# EAGLE design BBG_PROFET (EAGLE 9.5.2)
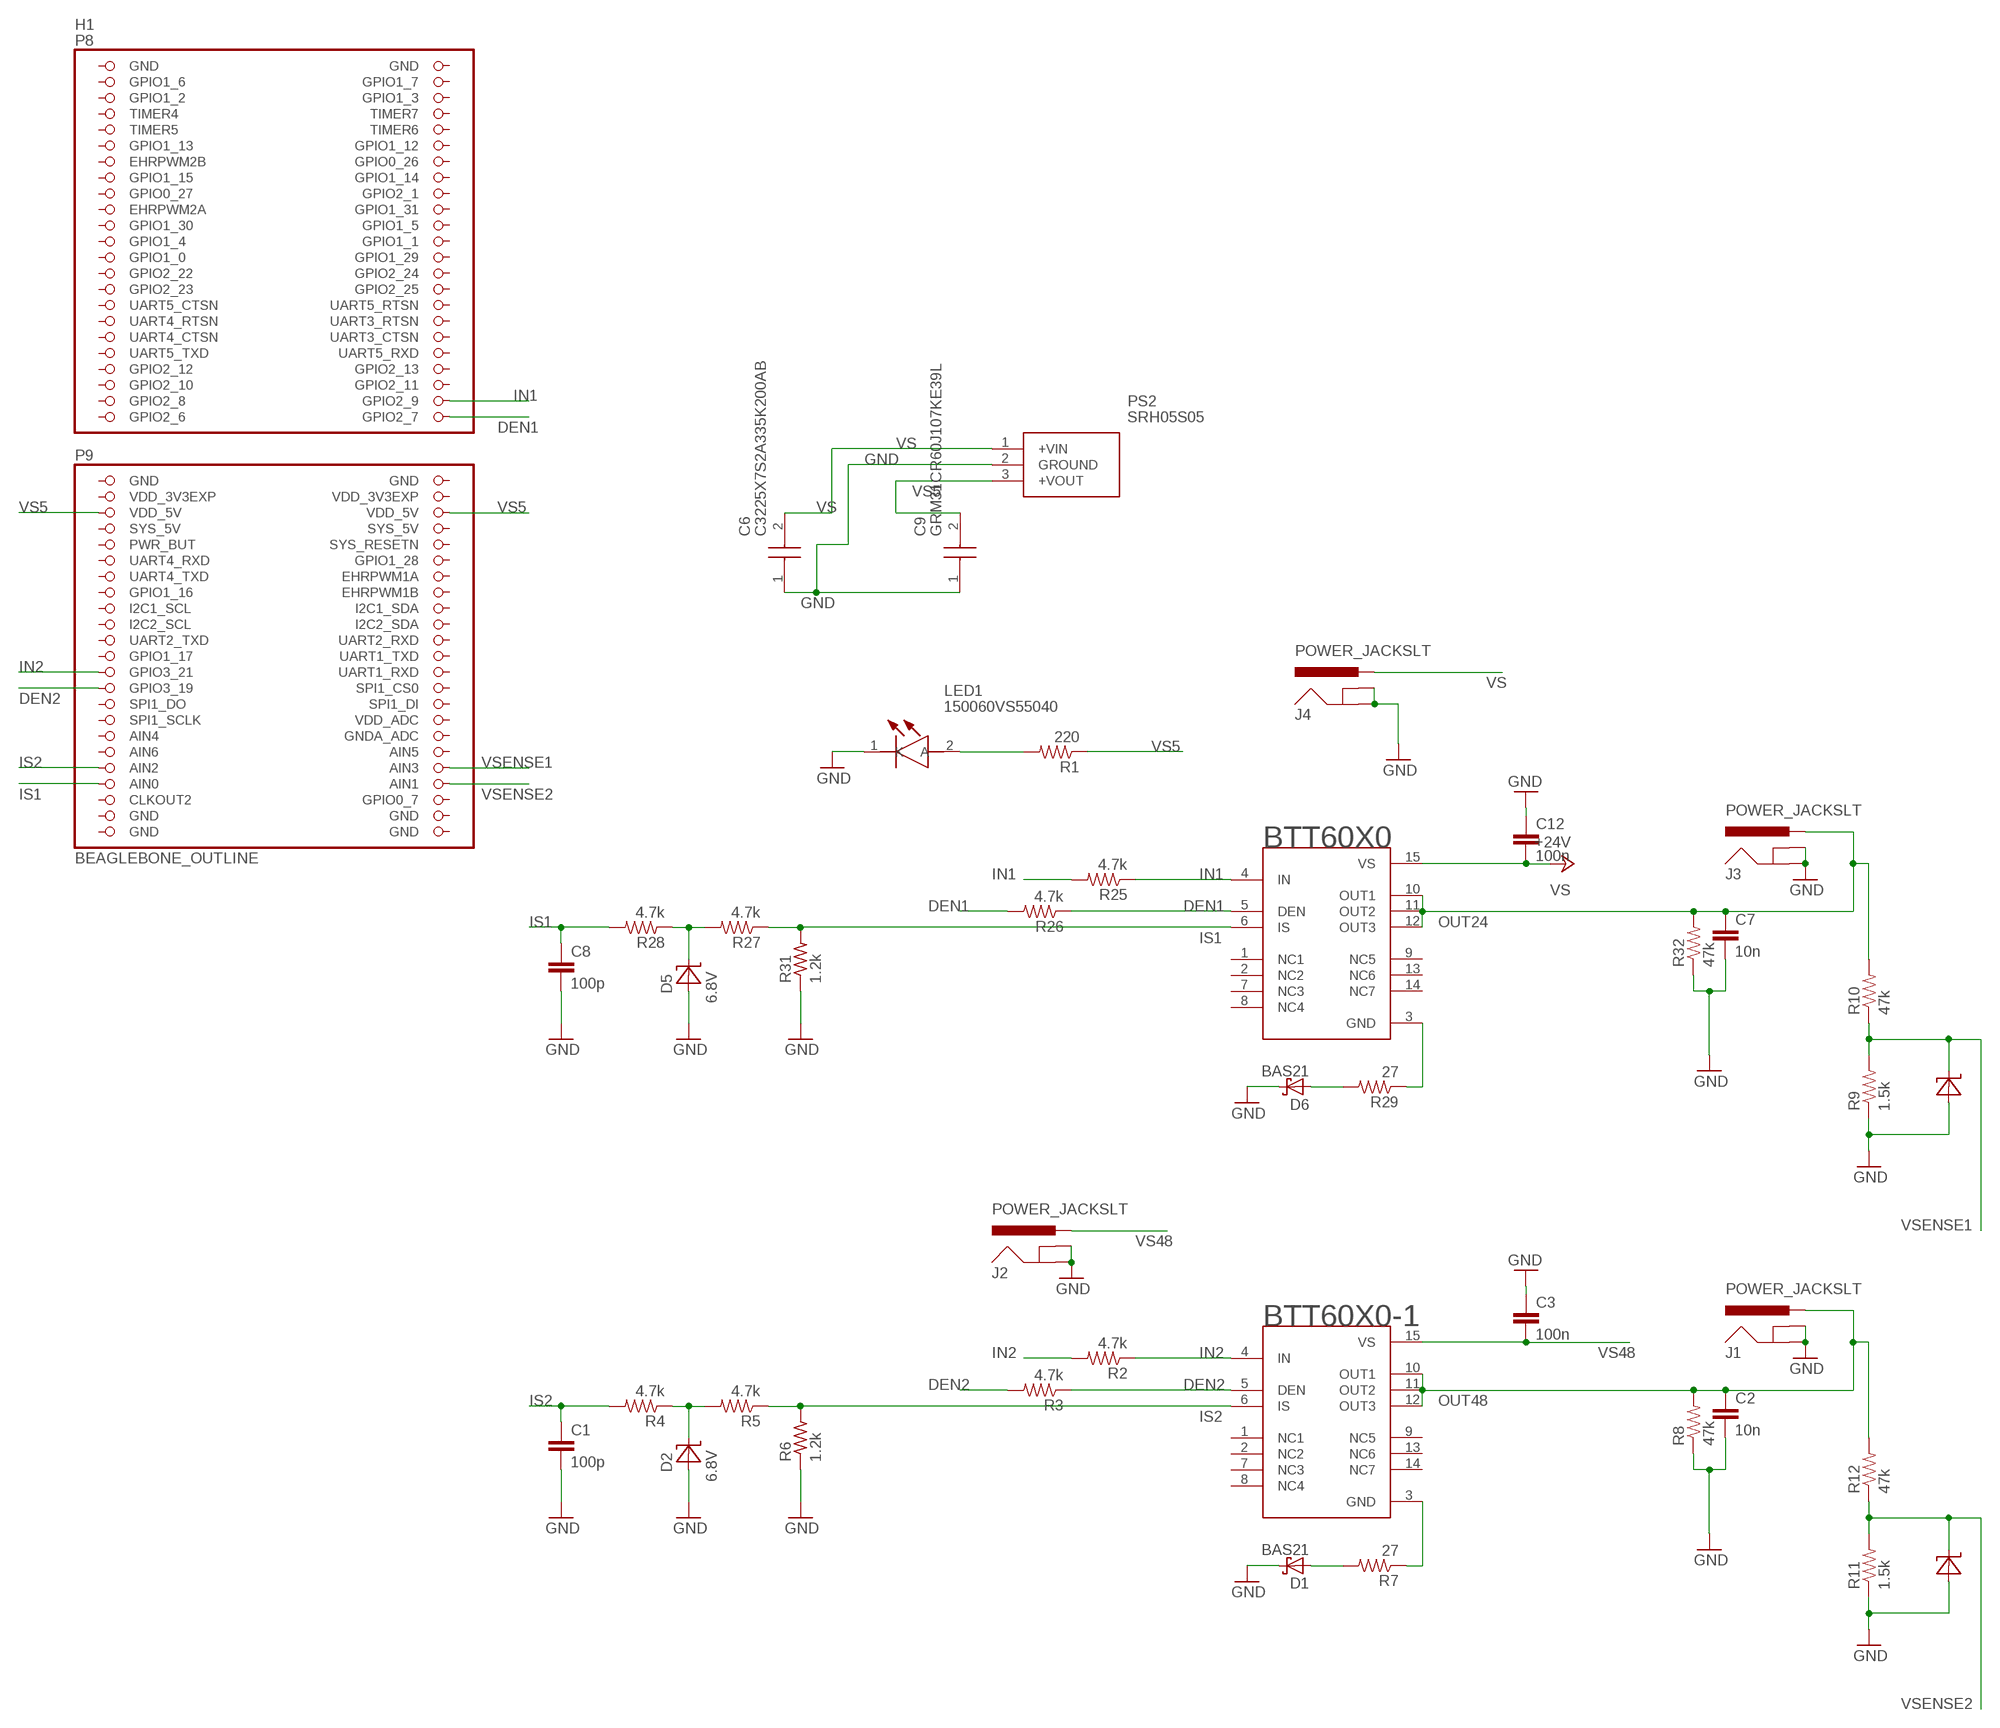
[diagram p0: schematic, sheet 1]

## Parts
BTT60X0  BTT6020-1ERA  [SOIC127P600X115-15N-V1]
BTT60X0-1  BTT6020-1ERA  [SOIC127P600X115-15N-V1]
C1  100p  CAP0603-CAP  [0603-CAP]
C2  10n  CAP0603-CAP  [0603-CAP]
C3  100n  CAP0603-CAP  [0603-CAP]
C6  C3225X7S2A335K200AB  [CAPC3225X200N]
C7  10n  CAP0603-CAP  [0603-CAP]
C8  100p  CAP0603-CAP  [0603-CAP]
C9  GRM31CR60J107KE39L  [CAPC3216X180N]
C12  100n  CAP0603-CAP  [0603-CAP]
D1  BAS21  BAS40  [SOT23]
D2  6.8V  SMD-PACKAGES_ZMM  [SMD-PACKAGES_SOD80]
D3  1.8V  SMD-PACKAGES_ZMM  [SMD-PACKAGES_SOD80]
D4  1.8V  SMD-PACKAGES_ZMM  [SMD-PACKAGES_SOD80]
D5  6.8V  SMD-PACKAGES_ZMM  [SMD-PACKAGES_SOD80]
D6  BAS21  BAS40  [SOT23]
H1  BEAGLEBONE_OUTLINE  [BEAGLEBONE_SHIELD]
J1  POWER_JACKSLT  [POWER_JACK_SLOT]
J2  POWER_JACKSLT  [POWER_JACK_SLOT]
J3  POWER_JACKSLT  [POWER_JACK_SLOT]
J4  POWER_JACKSLT  [POWER_JACK_SLOT]
LED1  150060VS55040  [LEDM168X50N]
PS2  SRH05S05  [SRH05S05]
R1  220  RESISTOR0603-RES  [0603-RES]
R2  4.7k  RESISTOR0603-RES  [0603-RES]
R3  4.7k  RESISTOR0603-RES  [0603-RES]
R4  4.7k  RESISTOR0603-RES  [0603-RES]
R5  4.7k  RESISTOR0603-RES  [0603-RES]
R6  1.2k  R-US_R1206  [R1206]
R7  27  RESISTOR0603-RES  [0603-RES]
R8  47k  RESISTOR0603-RES  [0603-RES]
R9  1.5k  RESISTOR0603-RES  [0603-RES]
R10  47k  RESISTOR0603-RES  [0603-RES]
R11  1.5k  RESISTOR0603-RES  [0603-RES]
R12  47k  RESISTOR0603-RES  [0603-RES]
R25  4.7k  RESISTOR0603-RES  [0603-RES]
R26  4.7k  RESISTOR0603-RES  [0603-RES]
R27  4.7k  RESISTOR0603-RES  [0603-RES]
R28  4.7k  RESISTOR0603-RES  [0603-RES]
R29  27  RESISTOR0603-RES  [0603-RES]
R31  1.2k  R-US_R1206  [R1206]
R32  47k  RESISTOR0603-RES  [0603-RES]

## Nets
DEN1: BTT60X0.5(DEN) H1.46(GPIO2_7) R26.1 R26.2
DEN2: BTT60X0-1.5(DEN) H1.73(GPIO3_19) R3.1 R3.2
GND: BTT60X0.3(GND) C1.2 C2.2 C3.1 C6.1 C7.2 C8.2 C9.1 C12.1 D1.3(C) D2.A D3.A D4.A D5.A D6.1(A) D6.3(C) J1.GND@1(GNDBREAK) J1.GND@2(GND) J2.GND@1(GNDBREAK) J2.GND@2(GND) J3.GND@1(GNDBREAK) J3.GND@2(GND) J4.GND@1(GNDBREAK) J4.GND@2(GND) LED1.1(K) PS2.2(GROUND) R6.1 R8.1 R9.1 R11.1 R29.1 R29.2 R31.1 R32.1
IN1: BTT60X0.4(IN) H1.44(GPIO2_9) R25.1 R25.2
IN2: BTT60X0-1.4(IN) H1.71(GPIO3_21) R2.1 R2.2
IS1: BTT60X0.6(IS) C8.1 D5.K(C) H1.85(AIN0) R27.1 R27.2 R28.1 R28.2 R31.2
IS2: BTT60X0-1.6(IS) C1.1 D2.K(C) H1.83(AIN2) R4.1 R4.2 R5.1 R5.2 R6.2
N$5: LED1.2(A) R1.2
N$6: BTT60X0-1.3(GND) R7.1
N$8: D1.1(A) R7.2
OUT24: BTT60X0.10(OUT1) BTT60X0.11(OUT2) BTT60X0.12(OUT3) C7.1 J3.PWR R10.2 R32.2
OUT48: BTT60X0-1.10(OUT1) BTT60X0-1.11(OUT2) BTT60X0-1.12(OUT3) C2.1 J1.PWR R8.2 R12.2
VS: BTT60X0.15(VS) C6.2 C12.2 J4.PWR PS2.1(+VIN) ; supply symbol labelled +24V
VS5: C9.2 H1.51(VDD_5V) H1.52(VDD_5V) PS2.3(+VOUT) R1.1
VS48: BTT60X0-1.15(VS) C3.2 J2.PWR
VSENSE1: D3.K(C) H1.84(AIN3) R9.2 R10.1
VSENSE2: D4.K(C) H1.86(AIN1) R11.2 R12.1
Unconnected: BTT60X0-1.1(NC1) BTT60X0-1.2(NC2) BTT60X0-1.7(NC3) BTT60X0-1.8(NC4) BTT60X0-1.9(NC5) BTT60X0-1.13(NC6) BTT60X0-1.14(NC7) BTT60X0.1(NC1) BTT60X0.2(NC2) BTT60X0.7(NC3) BTT60X0.8(NC4) BTT60X0.9(NC5) BTT60X0.13(NC6) BTT60X0.14(NC7) H1.3(GPIO1_6) H1.4(GPIO1_7) H1.5(GPIO1_2) H1.6(GPIO1_3) H1.7(TIMER4) H1.8(TIMER7) H1.9(TIMER5) H1.10(TIMER6) H1.11(GPIO1_13) H1.12(GPIO1_12) H1.13(EHRPWM2B) H1.14(GPIO0_26) H1.15(GPIO1_15) H1.16(GPIO1_14) H1.17(GPIO0_27) H1.18(GPIO2_1) H1.19(EHRPWM2A) H1.20(GPIO1_31) H1.21(GPIO1_30) H1.22(GPIO1_5) H1.23(GPIO1_4) H1.24(GPIO1_1) H1.25(GPIO1_0) H1.26(GPIO1_29) H1.27(GPIO2_22) H1.28(GPIO2_24) H1.29(GPIO2_23) H1.30(GPIO2_25) H1.31(UART5_CTSN) H1.32(UART5_RTSN) H1.33(UART4_RTSN) H1.34(UART3_RTSN) H1.35(UART4_CTSN) H1.36(UART3_CTSN) H1.37(UART5_TXD) H1.38(UART5_RXD) H1.39(GPIO2_12) H1.40(GPIO2_13) H1.41(GPIO2_10) H1.42(GPIO2_11) H1.43(GPIO2_8) H1.45(GPIO2_6) H1.54(SYS_5V) H1.55(PWR_BUT) H1.56(SYS_RESETN) H1.57(UART4_RXD) H1.58(GPIO1_28) H1.59(UART4_TXD) H1.60(EHRPWM1A) H1.61(GPIO1_16) H1.62(EHRPWM1B) H1.63(I2C1_SCL) H1.64(I2C1_SDA) H1.65(I2C2_SCL) H1.66(I2C2_SDA) H1.67(UART2_TXD) H1.68(UART2_RXD) H1.69(GPIO1_17) H1.70(UART1_TXD) H1.72(UART1_RXD) H1.74(SPI1_CS0) H1.75(SPI1_DO) H1.76(SPI1_DI) H1.77(SPI1_SCLK) H1.78(VDD_ADC) H1.79(AIN4) H1.80(GNDA_ADC) H1.81(AIN6) H1.82(AIN5) H1.87(CLKOUT2) H1.88(GPIO0_7)

## Power pins joined to a net without a drawn wire
GND: H1.1(GND) H1.2(GND) H1.47(GND) H1.48(GND) H1.89(GND) H1.90(GND) H1.91(GND) H1.92(GND)
SYS_5V: H1.53(SYS_5V)
VDD_3V3EXP: H1.49(VDD_3V3EXP) H1.50(VDD_3V3EXP)

## Library data of the parts
BTT60X0 BTT60X0-1 = BTT6020-1ERA:BTT6020-1ERA: BTT6020-1ERA SOIC127P600X115-15N-V1 Smart High-Side Power Switch Single Channel
C1-C3 C7 C8 C12 = SparkFun:CAP: Capacitor Standard 0603 ceramic capacitor, and 0.1" leaded capacitor.
C6 = SamacSys_Parts:C3225X7S2A335K200AB: TDK 1210 C 3.3uF Ceramic Multilayer Capacitor, 100 V dc, +125C, X7S Dielectric, +/-10% Source: Datasheet <https://componentsearchengine.com/Datasheets/1/C3225X7S2A335K200AB.pdf>; DESCRIPTION: TDK 1210 C 3.3uF Ceramic Multilayer Capacitor, 100 V dc, +125C, X7S Dielectric, +/-10%; HEIGHT: 2mm; MANUFACTURER_NAME: TDK; MANUFACTURER_PART_NUMBER: C3225X7S2A335K200AB; MOUSER_PART_NUMBER: 810-C3225X7S2A335K; MOUSER_PRICE-STOCK: https://www.mouser.com/Search/Refine.aspx?Keyword=810-C3225X7S2A335K
C9 = SamacSys_Parts:GRM31CR60J107KE39L: Multilayer Ceramic Capacitors MLCC - SMD/SMT Source: Datasheet <https://componentsearchengine.com/Datasheets/1/GRM31CR60J107KE39L.pdf>; DESCRIPTION: Multilayer Ceramic Capacitors MLCC - SMD/SMT; HEIGHT: 1.8mm; MANUFACTURER_NAME: Murata Electronics; MANUFACTURER_PART_NUMBER: GRM31CR60J107KE39L; MOUSER_PART_NUMBER: 81-GRM31CR60J107KE9L; MOUSER_PRICE-STOCK: https://www.mouser.com/Search/Refine.aspx?Keyword=81-GRM31CR60J107KE9L
D1 D6 = diode:BAS40: Silicon Schottky Diodes General-purpose diode for high-speed switching
D2-D5 = NovalithIC_H-Bridge_Demo_Board_V2_2:SMD-PACKAGES_ZMM: Werte: 1V, 2,7V ...51V Reihe E24
H1 = adafruit:BEAGLEBONE_OUTLINE: Should match A3 pinout - but not completely tested
J1-J4 = SparkFun-Connectors:POWER_JACK: Power Jack Connector This is the standard 5.5mm barrel jack for power. The PTH is the most common, proven, reliable, footprint. The Slot footprint only works if the mill layer is transmitted to the PCB fab house so be warned. Here are the connectors we sell at SparkFun: DC Barrel Power Jack/Connector <https://www.sparkfun.com/products/119> (PRT-00119) DC Barrel Power Jack/Connector (SMD) <https://www.sparkfun.com/products/12748> (PRT-12748) DC Barrel Jack Adapter - Breadboard Compatible <https://www.sparkfun.com/products/10811> (PRT-10811) It is used on this SparkFun product (and many, many others): SparkFun RedBoard - Programmed with Arduino <https://www.sparkfun.com/products/12757> (DEV-12757) Also, if you need a mating power supply or connector, please check these out: Wall Adapter Power Supply - 9VDC 650mA <https://www.sparkfun.com/products/298> (TOL-00298) DC Barrel Jack Adapter - Male <https://www.sparkfun.com/products/10287> (PRT-10287); PROD_ID: PRT-00119
LED1 = SamacSys_Parts:150060VS55040: LED, 150060VS55040, Wurth Elektronik WL-SMCD 573 (Typ.) nm 0603 Diffused SMD package Source: Datasheet <https://componentsearchengine.com/Datasheets/1/150060VS55040.pdf>; DESCRIPTION: LED, 150060VS55040, Wurth Elektronik WL-SMCD 573 (Typ.) nm 0603 Diffused SMD package; HEIGHT: 0.5mm; MANUFACTURER_NAME: Wurth Elektronik; MANUFACTURER_PART_NUMBER: 150060VS55040; MOUSER_PART_NUMBER: 710-150060VS55040; MOUSER_PRICE-STOCK: https://www.mouser.com/Search/Refine.aspx?Keyword=710-150060VS55040
PS2 = SamacSys_Parts:SRH05S05: XP Power DC-DC Switching Regulator, 9 72V dc Input, 5V dc Output, 500mA Source: Datasheet <https://componentsearchengine.com/Datasheets/1/SRH05S05.pdf>; DESCRIPTION: XP Power DC-DC Switching Regulator, 9 72V dc Input, 5V dc Output, 500mA; HEIGHT: 10.66mm; MANUFACTURER_NAME: XP POWER; MANUFACTURER_PART_NUMBER: SRH05S05; MOUSER_PART_NUMBER: 209-SRH05S05; MOUSER_PRICE-STOCK: https://www.mouser.com/Search/Refine.aspx?Keyword=209-SRH05S05
R1-R5 R7-R12 R25-R29 R32 = SparkFun:RESISTOR: Resistor Basic schematic elements and footprints for 0603, 1206, and PTH 1/10th watt (small) resistors.
R6 R31 = resistor:R-US_: RESISTOR, American symbol

## Board
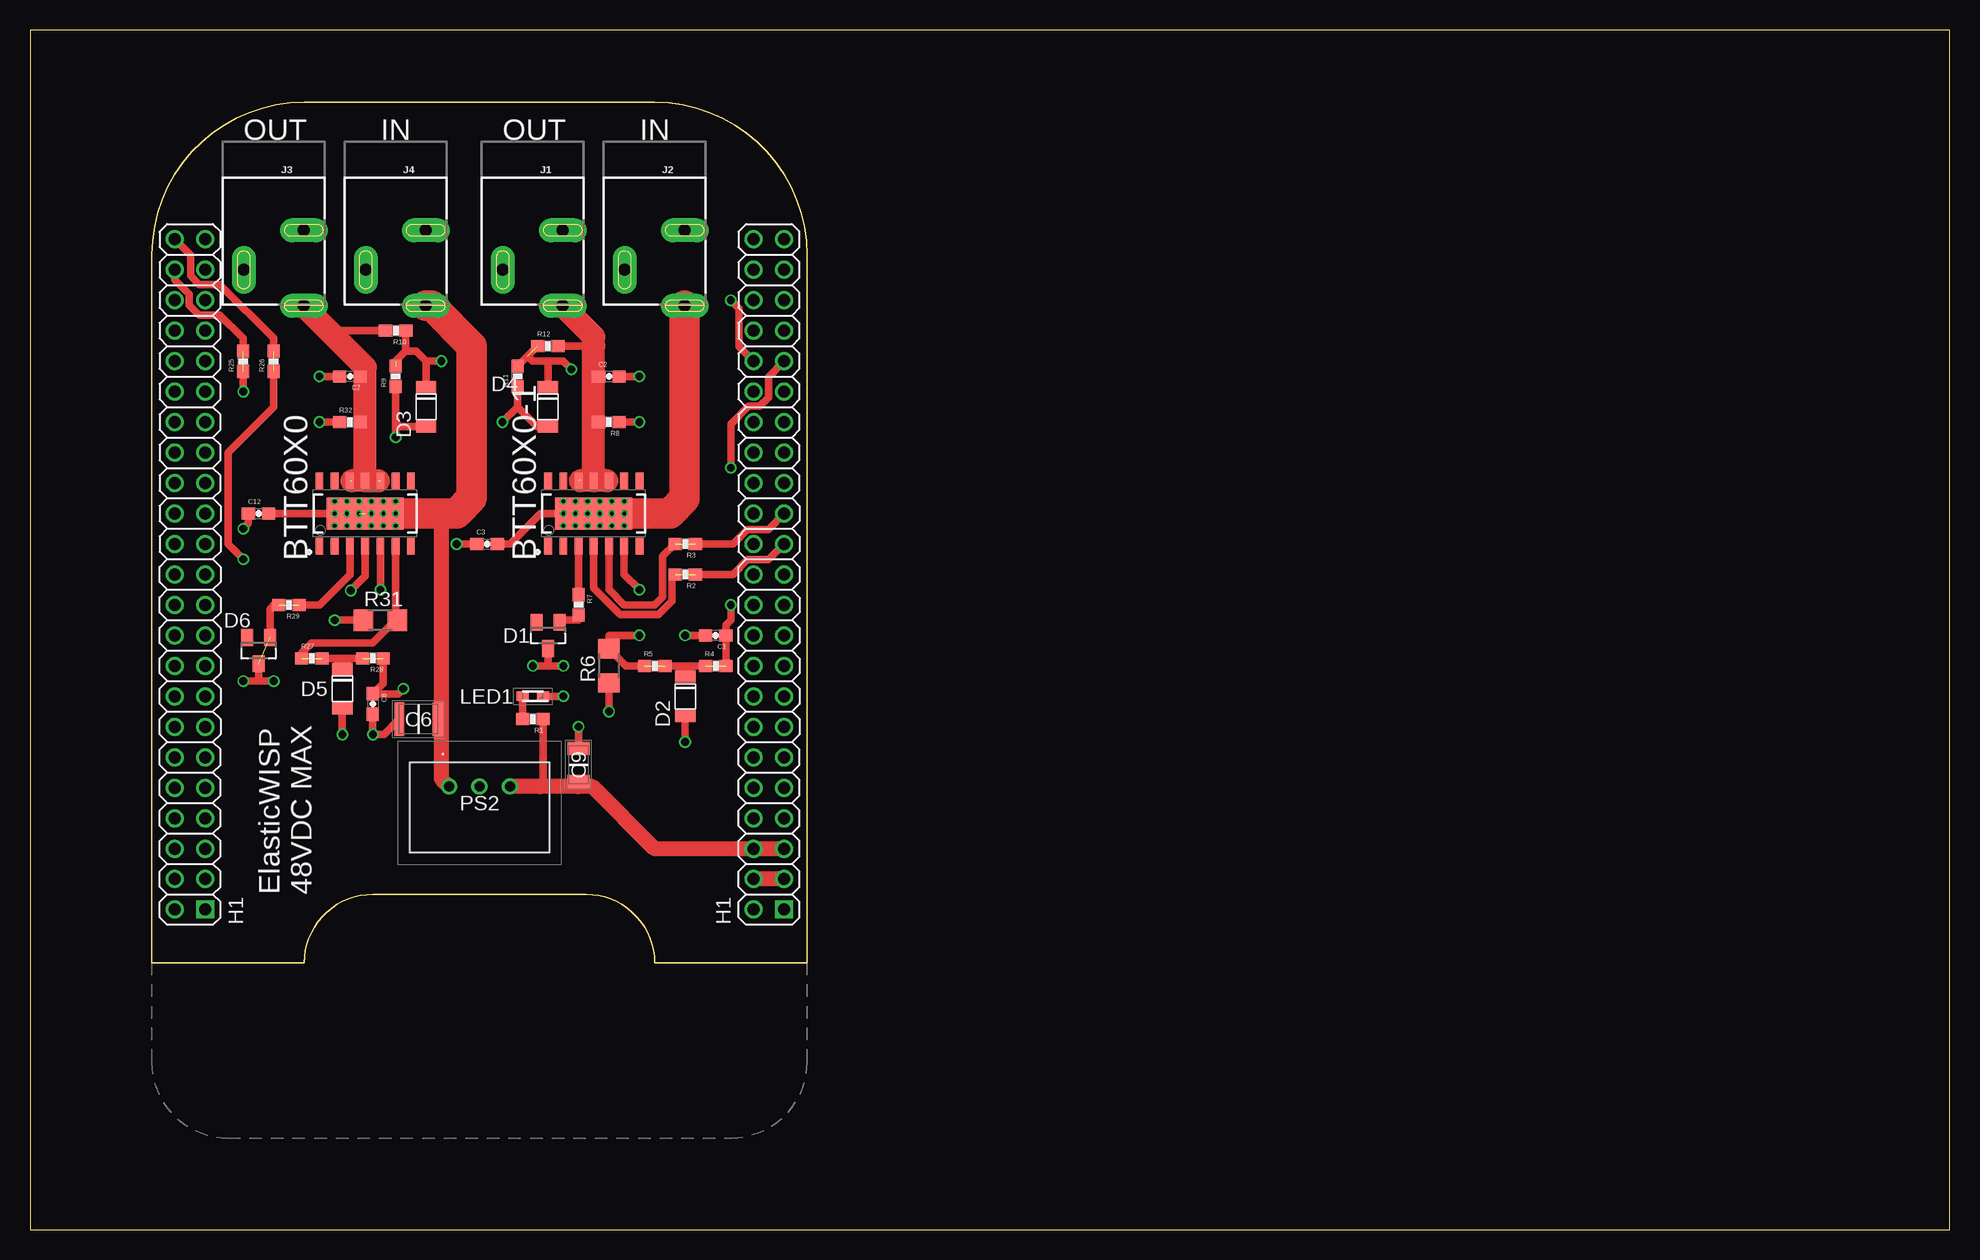
[diagram p1: board, top side]
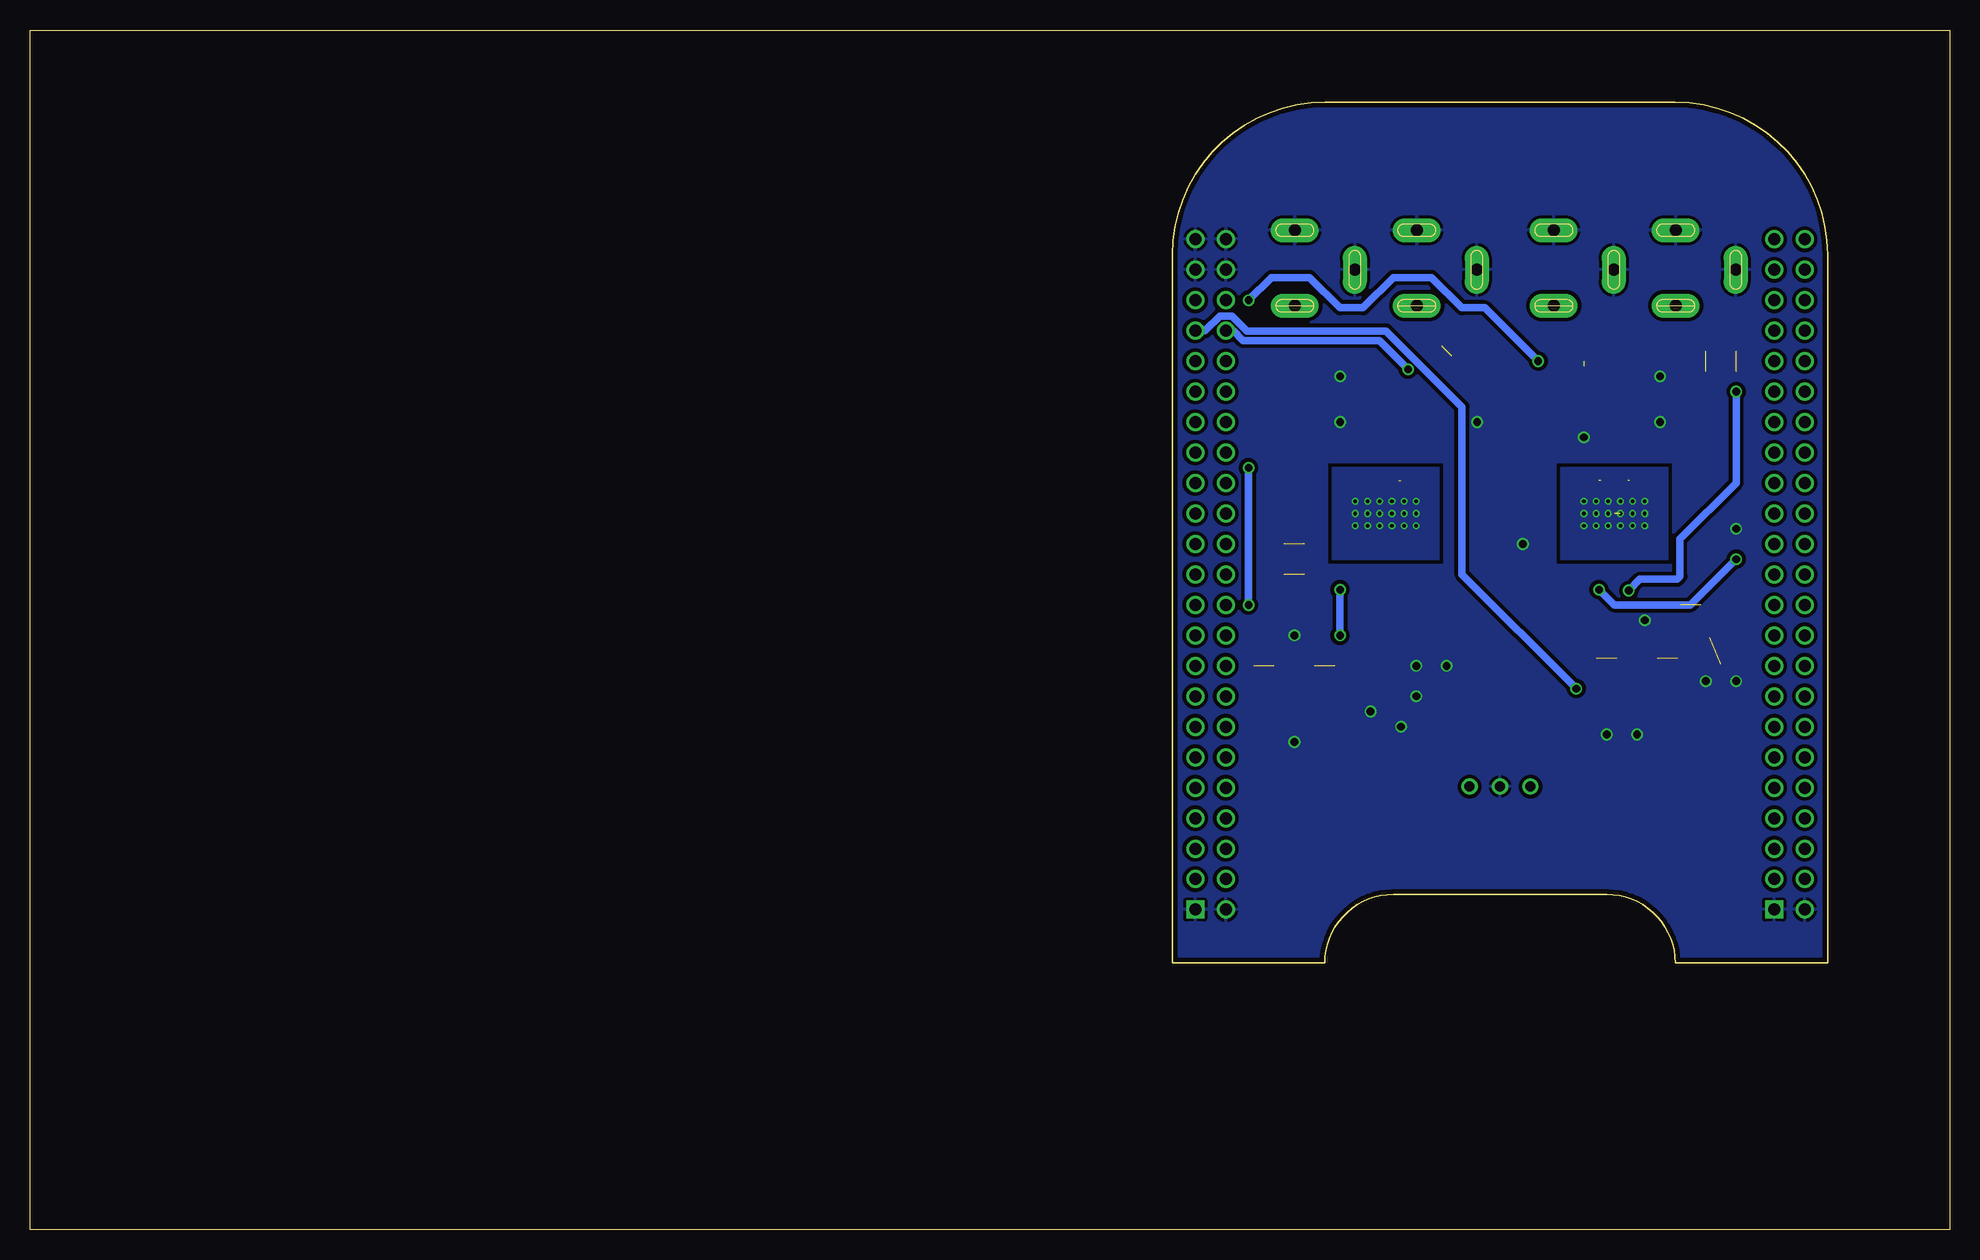
[diagram p2: board, bottom side, seen from below]

Size 160 x 100 mm. Coordinates in mm from the lower left corner, seen from the top.
Outline: 0,0 160,0 160,100 0,100 0,0
Copper layers (1*16): Top 0.035559375mm / dielectric 1.6mm / Bottom 0.035559375mm
Design rules "oshpark-2layer": minimum track width 6mil, minimum drill 10mil, track to track 6mil, track to pad 6mil, pad to pad 6mil, via to via 6mil, smd to smd 6mil, copper to edge 15mil, drill to drill 6mil, minimum pad ring 5mil, minimum via ring 5mil, stop-mask expansion 2.5mil, vias tented up to drill 0mil, thermal gap 10mil

### Footprints (pad centres in the part's own frame; a part is rotated, then mirrored left to right if it is on the bottom)
SOIC127P600X115-15N-V1 = smd 1.34 x 0.65: 1 -2.73,3.81; 2 -2.73,2.54; 3 -2.73,1.27; 4 -2.73,0; 5 -2.73,-1.27; 6 -2.73,-2.54; 7 -2.73,-3.81; 8 2.73,-3.81; 9 2.73,-2.54; 10 2.73,-1.27; 11 2.73,0; 12 2.73,1.27; 13 2.73,2.54; 14 2.73,3.81 | smd 2.65 x 6.4: 15 0,0
0603-CAP = smd 1.1 x 1: 1 -0.85,0; 2 0.85,0
CAPC3225X200N = smd 0.81 x 2.82: 1 -1.6,0; 2 1.6,0
CAPC3216X180N = smd 1.07 x 1.82: 1 -1.38,0; 2 1.38,0
SOT23 = smd 1 x 1.4: 1 -0.95,-1.1; 2 0.95,-1.1; 3 0,1.1
SMD-PACKAGES_SOD80 = smd 1 x 1.7: A -1.65,0; K 1.65,0
BEAGLEBONE_SHIELD = drill 1 square: 1 4.445,19.05; 47 52.705,19.05 | drill 1: 2 1.905,19.05; 3 4.445,21.59; 4 1.905,21.59; 5 4.445,24.13; 6 1.905,24.13; 7 4.445,26.67; 8 1.905,26.67; 9 4.445,29.21; 10 1.905,29.21; 11 4.445,31.75; 12 1.905,31.75; 13 4.445,34.29; 14 1.905,34.29; 15 4.445,36.83; 16 1.905,36.83; 17 4.445,39.37; 18 1.905,39.37; 19 4.445,41.91; 20 1.905,41.91; 21 4.445,44.45; 22 1.905,44.45; 23 4.445,46.99; 24 1.905,46.99; 25 4.445,49.53; 26 1.905,49.53; 27 4.445,52.07; 28 1.905,52.07; 29 4.445,54.61; 30 1.905,54.61; 31 4.445,57.15; 32 1.905,57.15; 33 4.445,59.69; 34 1.905,59.69; 35 4.445,62.23; 36 1.905,62.23; 37 4.445,64.77; 38 1.905,64.77; 39 4.445,67.31; 40 1.905,67.31; 41 4.445,69.85; 42 1.905,69.85; 43 4.445,72.39; 44 1.905,72.39; 45 4.445,74.93; 46 1.905,74.93; 48 50.165,19.05; 49 52.705,21.59; 50 50.165,21.59; 51 52.705,24.13; 52 50.165,24.13; 53 52.705,26.67; 54 50.165,26.67; 55 52.705,29.21; 56 50.165,29.21; 57 52.705,31.75; 58 50.165,31.75; 59 52.705,34.29; 60 50.165,34.29; 61 52.705,36.83; 62 50.165,36.83; 63 52.705,39.37; 64 50.165,39.37; 65 52.705,41.91; 66 50.165,41.91; 67 52.705,44.45; 68 50.165,44.45; 69 52.705,46.99; 70 50.165,46.99; 71 52.705,49.53; 72 50.165,49.53; 73 52.705,52.07; 74 50.165,52.07; 75 52.705,54.61; 76 50.165,54.61; 77 52.705,57.15; 78 50.165,57.15; 79 52.705,59.69; 80 50.165,59.69; 81 52.705,62.23; 82 50.165,62.23; 83 52.705,64.77; 84 50.165,64.77; 85 52.705,67.31; 86 50.165,67.31; 87 52.705,69.85; 88 50.165,69.85; 89 52.705,72.39; 90 50.165,72.39; 91 52.705,74.93; 92 50.165,74.93
POWER_JACK_SLOT = drill 1 pad 2 long: GND@1 2.58,7.5; GND@2 7.58,10.8; PWR 2.58,13.8
LEDM168X50N = smd 1 x 0.8: 1 -0.85,0; 2 0.85,0
SRH05S05 = drill 0.83 pad 1.349: 1 -2.54,1.375; 2 0,1.375; 3 2.54,1.375
0603-RES = smd 1.1 x 1: 1 -0.85,0; 2 0.85,0
R1206 = smd 1.6 x 1.803: 1 -1.422,0; 2 1.422,0

### Placement (x,y rotation side)
BTT60X0  27.94,59.69 90 top
BTT60X0-1  46.99,59.69 90 top
C1  57.15,49.53 180 top
C2  48.26,71.12 0 top
C3  38.1,57.15 0 top
C6  32.38,42.55 0 top
C7  26.67,71.12 180 top
C8  28.57,43.81 270 top
C9  45.72,38.73 270 top
C12  19.05,59.69 0 top
D1  43.18,49.53 180 top
D2  54.61,44.45 90 top
D3  33.02,68.58 90 top
D4  43.18,68.58 90 top
D5  26.04,45.09 90 top
D6  19.05,48.26 180 top
H1  10.16,7.62 0 top
J1  46.99,90.81 180 top
J2  57.15,90.81 180 top
J3  25.4,90.81 180 top
J4  35.56,90.81 180 top
LED1  41.91,44.45 180 top
PS2  37.47,35.56 0 top
R1  41.91,42.55 180 top
R2  54.61,54.61 180 top
R3  54.61,57.15 180 top
R4  57.15,46.99 0 top
R5  52.07,46.99 0 top
R6  48.26,46.99 90 top
R7  45.72,52.07 270 top
R8  48.26,67.31 180 top
R9  30.48,71.12 90 top
R10  30.48,74.93 180 top
R11  40.64,71.12 90 top
R12  43.18,73.66 0 top
R25  17.78,72.39 90 top
R26  20.32,72.39 90 top
R27  23.5,47.62 0 top
R28  28.57,47.62 180 top
R29  21.59,52.07 180 top
R31  29.21,50.8 0 top
R32  26.67,67.31 0 top

### Tracks (layer width: path | path; a pad name or v marks a point on that pad's centre or on a via)
DEN1  (via drill 0.65)  (1 unrouted)
  Top 0.635: R26.2 20.32,74.3 15.83,78.79 14.1,78.79 13.38,79.5 13.38,81.23 H1.46 | BTT60X0.5 29.21,55.88 v29.21,53.34 | R26.1 20.32,68.58 16.51,64.77 16.51,57.15 v17.78,55.88
  Bottom 0.635: v29.21,53.34 27.94,52.07 21.59,52.07 v17.78,55.88
DEN2  (1 unrouted)
  Top 0.635: R3.2 52.74,56.13 52.74,52.74 52.07,52.07 49.53,52.07 48.26,53.34 BTT60X0-1.5 | H1.73 61.55,58.37 59.82,58.37 58.6,57.15 R3.1
GND  (via drill 0.65)  (2 unrouted)
  Top 0.635: v24.13,67.31 R32.1 | R31.1 v25.4,50.8 | BTT60X0.3 26.67,54.61 24.13,52.07 R29.1 | D6.3 19.05,45.72 | 19.05,45.72 v17.78,45.72 | LED1.1 v44.45,44.45 | D1.3 43.18,46.99 | v41.91,46.99 43.18,46.99 | 43.18,46.99 v44.45,46.99 | v24.13,71.12 C7.2 | C2.2 v50.8,71.12 | R8.1 v50.8,67.31 | v35.56,57.15 C3.1 | v48.26,43.18 R6.1 | v54.61,40.64 D2.A | v54.61,49.53 C1.2 | R29.2 20.32,52.07 20,51.75 D6.1 | v20.32,45.72 19.05,45.72 | C8.2 v28.57,41.27 29.52,41.27 C6.1 | v26.04,41.27 D5.A | R11.1 40.64,68.58 | 40.64,68.58 v39.37,67.31 | 40.64,68.58 42.29,66.93 D4.A | R9.1 30.48,67.31 | 30.48,67.31 v30.48,66.04 | D3.A 30.86,66.93 30.48,67.31 | C12.1 18.2,58.84 v17.78,58.42 | v45.72,41.91 C9.1
  pour Bottom (isolate 0.305, rank 2): 22.86,93.98 52.07,93.98 arc-90 64.77,81.28 64.77,22.23 10.16,22.23 10.16,81.28 arc-90
IN1  (via drill 0.65)  (1 unrouted)
  Top 0.635: R25.1 v17.78,69.85 | v26.74,53.27 27.94,54.47 BTT60X0.4 | H1.44 12.06,79.2 13.29,77.98 13.29,77.06 14.1,76.25 15.83,76.25 17.78,74.3 R25.2
  Bottom 0.635: v17.78,69.85 17.78,62.23 22.47,57.54 22.47,54.45 22.7,54.22 25.79,54.22 v26.74,53.27
IN2  (1 unrouted)
  Top 0.635: H1.71 61.55,55.83 59.82,55.83 58.59,54.61 R2.1 | R2.2 53.53,54.38 53.53,52.41 52.4,51.28 49.53,51.28 49.2,51.28 46.99,53.5 BTT60X0-1.4
IS1  (via drill 0.65)  (2 unrouted)
  Top 0.635: R31.2 30.48,50.95 BTT60X0.6 | 30.48,50.65 R31.2 | 26.04,47.62 D5.K 26.04,46.99 | 26.04,47.62 25.4,47.62 | 25.4,47.62 R27.2 | 26.04,47.62 26.67,47.62 | 26.67,47.62 R28.2 | R27.1 22.64,48.05 23.5,48.9 28.57,48.9 30.48,50.8 R31.2 | v31.11,45.09 30.7,44.66 C8.1 29.43,45.52 R28.1 | 26.04,46.99 25.4,47.62 | 26.04,46.99 26.67,47.62
  Bottom 0.635: v31.11,45.09 40.64,54.61 40.64,68.58 46.96,74.9 58.56,74.9 59.82,76.15 60.83,76.15 62.06,74.93 H1.85
IS2  (via drill 0.65)  (2 unrouted)
  Top 0.635: H1.83 61.55,71.07 61.55,69.34 60.83,68.63 59.91,68.63 58.42,67.14 v58.42,63.5 | BTT60X0-1.6 49.53,54.61 v50.8,53.34 | v50.8,49.53 48.26,49.53 R6.2 49.68,46.99 R5.1 | R5.2 53.98,46.99 | 53.98,46.99 54.61,46.99 | 54.61,46.99 55.24,46.99 | 55.24,46.99 R4.1 | 54.61,46.99 D2.K 54.61,46.35 | R4.2 C1.1 58,50.38 58.42,50.8 v58.42,52.07 | 54.61,46.35 55.24,46.99 | 54.61,46.35 53.98,46.99
  Bottom 0.635: v58.42,63.5 v58.42,52.07 | v50.8,53.34 v50.8,49.53
N$5
  Top 0.635: R1.2 LED1.2
N$6
  Top 0.635: R7.1 BTT60X0-1.3
N$8
  Top 0.635: R7.2 45.72,50.8 44.45,50.8 44.3,50.8 D1.1
OUT24  (2 unrouted)
  Top 0.635: BTT60X0.11 27.94,66.89 R32.2 C7.1 | R10.2 24.89,74.93 J3.PWR
  Top 1.905: BTT60X0.11 27.94,71.89 J3.PWR | BTT60X0.11 26.83,62.42 | BTT60X0.11 29.05,62.42
OUT48  (1 unrouted)
  Top 0.635: C2.1 R8.2 46.99,66.89 BTT60X0-1.11 | R12.2 46.99,73.66
  Top 1.27: BTT60X0-1.10 BTT60X0-1.11
  Top 1.905: J1.PWR 46.99,74.42 46.99,73.66 BTT60X0-1.11 | BTT60X0-1.11 45.88,62.42 | 48.1,62.42 BTT60X0-1.11
VDD_3V3EXP
  Top 1.27: H1.49 H1.50
VS  (via drill 0.3)  (1 unrouted)
  Top 0.152: C6.2 34.28,42.24 34.28,40.64
  Top 0.635: C12.2 v25.4,59.69 26.04,59.69
  Top 1.27: 34.29,59.69 34.29,57.68 34.28,57.68 34.28,40.64 34.28,37.58 PS2.1
  Top 2.54: J4.PWR 33.48,77 36.83,73.66 36.83,60.96 35.56,59.69 34.29,59.69 v30.48,59.69 29.84,59.69
  other vias: 25.4,60.71 25.4,58.67 26.42,60.71 26.42,59.69 26.42,58.67 27.43,60.71 27.43,59.69 27.43,58.67 28.45,58.67 28.45,59.69 28.45,60.71 29.46,60.71 30.48,60.71 30.48,58.67 29.46,58.67 29.46,59.69
  pour Bottom (isolate 0.305): 23.5,63.5 32.38,63.5 32.38,55.88 23.5,55.88
VS5
  Top 0.635: R1.1 42.76,37.15 42.55,36.94 | C9.2 45.72,36.94
  Top 1.27: H1.51 H1.52 52.07,31.75 46.88,36.94 45.72,36.94 42.55,36.94 PS2.3
VS48  (via drill 0.3)
  Top 0.635: C3.2 40.01,57.15 42.55,59.69 v44.45,59.69 45.09,59.69
  Top 2.54: BTT60X0-1.15 v47.5,59.69 v48.51,59.69 v49.53,59.69 53.34,59.69 54.57,60.92 J2.PWR
  other vias: 44.45,60.71 45.47,60.71 46.48,60.71 47.5,60.71 48.51,60.71 49.53,60.71 45.47,59.69 46.48,59.69 44.45,58.67 45.47,58.67 46.48,58.67 47.5,58.67 48.51,58.67 49.53,58.67
  pour Bottom (isolate 0.305): 42.55,63.5 51.44,63.5 51.44,55.88 42.55,55.88
VSENSE1  (via drill 0.65)  (1 unrouted)
  Top 0.635: D3.K 33.02,72.39 | 33.02,72.39 v34.29,72.39 | v58.42,77.47 59.1,76.78 59.1,73.61 H1.84 | R10.1 31.33,73.24 | 31.33,73.24 30.48,72.39 | 33.02,72.39 32.17,73.24 31.33,73.24
  Bottom 0.635: v58.42,77.47 56.52,79.38 53.34,79.38 50.8,76.83 48.9,76.83 46.35,79.38 43.18,79.38 40.64,76.83 38.73,76.83 v34.29,72.39
VSENSE2  (via drill 0.65)  (1 unrouted)
  Top 0.635: 41.48,72.81 41.91,72.39 43.18,72.39 | 43.18,72.39 44.45,72.39 v45.13,71.71 | R12.1 R11.2 | D4.K 43.18,72.39
  Bottom 0.635: v45.13,71.71 47.53,74.11 58.89,74.11 59.71,74.93 H1.86

### Text on the board
tPlace: OUT | IN | OUT | IN | ElasticWISP / 48VDC MAX